# Altium schematic sheet PWR_P2V5.SchDoc: Power + 2.5 V
size 297 x 209 mm; Author: P. Zdunek; DrawnBy: P. Zdunek; DocumentNumber: 31; SheetNumber: 31; SheetTotal: 37
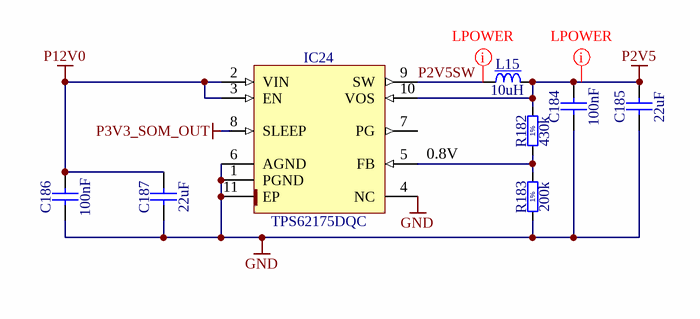
[diagram p0: PWR_P2V5.SchDoc]

## Parts
C184  100nF  [CAPC1005X55N]
C185  22uF  [CAPC2012X135N]
C186  100nF  [CAPC1005X55N]
C187  22uF  [CAPC2012X135N]
IC24  TPS62175DQC  [SON50P200X300X80-11N-R94X250]
L15  10uH  [IND_MURATA-PS_8400]
R182  430k  [RESC1005X40N]
R183  200k  [RESC1005X40N]

## Nets
GND: C184.1 C185.1 C186.1 C187.1 IC24.1(PGND) IC24.4(NC) IC24.6(AGND) IC24.11(EP) R183.1
P2V5: C184.2 C185.2 IC24.10(VOS) L15.2 R182.2
P3V3_SOM_OUT: IC24.8(SLEEP)
P12V0: C186.2 C187.2 IC24.2(VIN) IC24.3(EN)
P2V5SW: IC24.9(SW) L15.1
NetIC24_5: IC24.5(FB) R182.1 R183.2

Not connected (* = marked no-connect by the designer): IC24 7(PG)

## Layout directives
net class Lpower: P2V5, P2V5SW

## Notes on the sheet
- (near IC24) 0.8V
- Project
- Document
- Designer
- Drawn by
- Check.by
- File
- Last Mod.
- Print Date
- Sheet
- Size
- A4
- of
- Rev
- (in symbol R0402_200K_1%_0.0625W_100PPM) 1%
- (in symbol R0402_430K_1%_0.0625W_100PPM) 1%

## Library data of the parts
C184 C186 = CC0402_100NF_16V_10%_X5R: Non-polarised capacitor; Part Description: SMD Multilayer Chip Ceramic Capacitor; Manufacturer: GENERIC; Manufacturer1 Part Number: GRM155R61C104KA88D; Voltage: 16V; TC: X5R; Tolerance: ±10%; Part Number: CC0402_100NF_16V_10%_X5R; Component Kind: Standard; Component Type: Standard; Pin Count: 2; Value: 100nF; Status: None; Manufacturer Part Number: CC0402_100NF_16V_10%_X5R; Case: 0402; Mounted: Yes; Socket: No; SMD: Yes; Sense: No; Manufacturer1 Example: MURATA; Manufacturer1 ComponentHeight: 0.55mm; HelpURL: \\cern.ch\dfs\Applications\Altium\Datasheets\CC0402_X5R_MURATA_GRM.pdf; Author: CERN DEM JLC; CreateDate: 10.12.2013; LatestRevisionDate: 10.12.2013
C185 C187 = CC0805_22UF_16V_10%_X5R: Non-polarised capacitor; Part Description: SMD Multilayer Chip Ceramic Capacitor; Manufacturer: GENERIC; Manufacturer1 Part Number: C2012X5R1C226KT; Voltage: 16V; TC: X5R; Tolerance: ±10%; Part Number: CC0805_22UF_16V_10%_X5R; Component Kind: Standard; Component Type: Standard; Pin Count: 2; Value: 22uF; Status: Preferred; Manufacturer Part Number: CC0805_22UF_16V_10%_X5R; Case: 0805; Mounted: Yes; Socket: No; SMD: Yes; Sense: No; Manufacturer1 Example: TDK; Manufacturer1 ComponentHeight: 1.35mm; HelpURL: \\cern.ch\dfs\Applications\Altium\Datasheets\CC0805_X5R_TDK_C.pdf; Author: CERN DEM JLC; CreateDate: 25.10.2012; LatestRevisionDate: 25.10.2012
IC24 = TPS62175DQC: 4.75-28VDC to 1-6VDC, 500mA Step-Down Converter With Sleep Mode; Manufacturer: TEXAS INSTRUMENTS; PressFit: No; Bonding: No; Part Number: TPS62175DQC; Component Kind: Standard; Component Type: Standard; Device: TPS62175DQC; PackageDescription: SON, 10-Leads, Body 2x3mm, Pitch 0.5mm, Thermal Pad 0.94x2.5mm, IPC Medium Density; Part Description: 4.75-28VDC to 1-6VDC, 500mA Step-Down Converter With Sleep Mode; Manufacturer Part Number: TPS62175DQC; Pin Count: 11; Case: SON10; Mounted: Yes; Socket: No; SMD: Yes; Sense: No; ComponentHeight: 0.8mm; HelpURL: \\cern.ch\dfs\Applications\Altium\Datasheets\TPS62175DQC.pdf; Author: CERN DEM JMW; CreateDate: 11.08.2015; LatestRevisionDate: 11.08.2015
L15 = IND_10UH_10%_MURATA-PS_8400: Inductor With Core; Part Description: Miniature Surface Mount Power Inductor (8400 Serie); Manufacturer: MURATA POWER SOLUTIONS; Manufacturer Part Number: 84103C; Power: 950mA; Resistance: 0.24R; Tolerance: ±10%; Part Number: IND_10UH_10%_MURATA-PS_8400; Component Kind: Standard; Component Type: Standard; Pin Count: 2; Value: 10uH; Status: None; Mounted: Yes; Socket: No; SMD: Yes; Sense: No; ComponentHeight: 2.9mm; HelpURL: \\cern.ch\dfs\Applications\Altium\Datasheets\IND_MURATA-PS_8400.pdf; Author: CERN DEM JLC; CreateDate: 02.07.2012; LatestRevisionDate: 02.07.2012
R182 = R0402_430K_1%_0.0625W_100PPM: Resistor - 1%; Part Description: General Purpose Thick Film Chip Resistor; Manufacturer: GENERIC; Manufacturer1 Part Number: 232270674304L; TC: ±100ppm/°C; PressFit: No; Part Number: R0402_430K_1%_0.0625W_100PPM; Component Kind: Standard; Component Type: Standard; Pin Count: 2; Value: 430k; Status: Not Recommended; Power: 0.0625W; Tolerance: ±1%; Manufacturer Part Number: R0402_430K_1%_0.0625W_100PPM; Case: 0402; Mounted: Yes; Sense: No; Socket: No; SMD: Yes; Manufacturer1 Example: YAGEO PHYCOMP; Manufacturer1 ComponentHeight: 0.4mm; HelpURL: \\cern.ch\dfs\Applications\Altium\Datasheets\R0402_Phycomp_RC0402.pdf; Author: CERN DEM JLC; CreateDate: 03/12/2007; LatestRevisionDate: 17/10/2012
R183 = R0402_200K_1%_0.0625W_100PPM: Resistor - 1%; Part Description: General Purpose Thick Film Chip Resistor; Manufacturer: GENERIC; Manufacturer1 Part Number: 232270672004L; TC: ±100ppm/°C; PressFit: No; Part Number: R0402_200K_1%_0.0625W_100PPM; Component Kind: Standard; Component Type: Standard; Pin Count: 2; Value: 200k; Status: Not Recommended; Power: 0.0625W; Tolerance: ±1%; Manufacturer Part Number: R0402_200K_1%_0.0625W_100PPM; Case: 0402; Mounted: Yes; Sense: No; Socket: No; SMD: Yes; Manufacturer1 Example: YAGEO PHYCOMP; Manufacturer1 ComponentHeight: 0.4mm; HelpURL: \\cern.ch\dfs\Applications\Altium\Datasheets\R0402_Phycomp_RC0402.pdf; Author: CERN DEM JLC; CreateDate: 03/12/2007; LatestRevisionDate: 17/10/2012